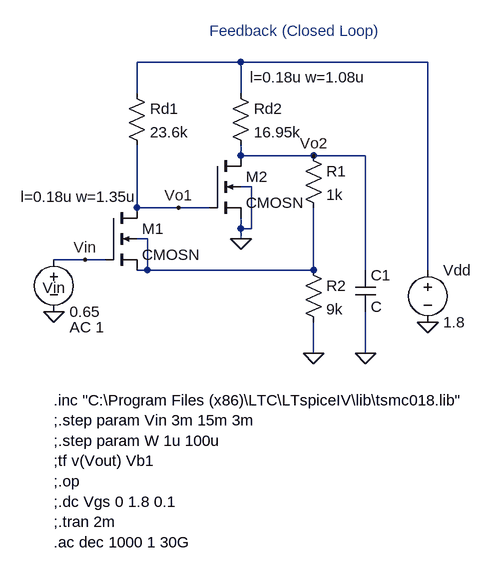
[diagram p0: schematic feedback1.asc]
feedback1.asc, the LTspice schematic file:
Version 4
SHEET 1 880 680
WIRE 224 -48 64 -48
WIRE 512 -48 224 -48
WIRE 64 0 64 -48
WIRE 224 0 224 -48
WIRE 224 96 224 80
WIRE 336 96 224 96
WIRE 416 96 336 96
WIRE 240 144 224 144
WIRE 64 176 64 80
WIRE 128 176 64 176
WIRE 176 176 128 176
WIRE 224 208 224 192
WIRE 240 208 240 144
WIRE 240 208 224 208
WIRE 80 224 64 224
WIRE 224 224 224 208
WIRE -16 256 -64 256
WIRE 16 256 -16 256
WIRE 80 272 80 224
WIRE 80 272 64 272
WIRE 336 272 336 176
WIRE 336 272 80 272
WIRE 416 272 416 96
WIRE 512 272 512 -48
WIRE 336 400 336 352
WIRE 416 400 416 336
FLAG 224 224 0
FLAG -64 336 0
FLAG 336 400 0
FLAG 512 352 0
FLAG 336 96 Vo2
FLAG -16 256 Vin
FLAG 128 176 Vo1
FLAG 416 400 0
SYMBOL cmosn 16 176 R0
WINDOW 123 -131 -17 Left 2
SYMATTR Value2 l=0.18u w=1.35u
SYMATTR InstName M1
SYMBOL cmosn 176 96 R0
WINDOW 123 62 -121 Left 2
SYMATTR Value2 l=0.18u w=1.08u
SYMATTR InstName M2
SYMBOL res 48 -16 R0
SYMATTR InstName Rd1
SYMATTR Value 23.6k
SYMBOL res 208 -16 R0
SYMATTR InstName Rd2
SYMATTR Value 16.95k
SYMBOL res 320 256 R0
SYMATTR InstName R2
SYMATTR Value 9k
SYMBOL res 320 80 R0
SYMATTR InstName R1
SYMATTR Value 1k
SYMBOL voltage -64 240 R0
WINDOW 0 -17 59 Left 2
WINDOW 123 24 120 Left 2
WINDOW 39 0 0 Left 2
SYMATTR InstName Vin
SYMATTR Value2 AC 1
SYMATTR Value 0.65
SYMBOL voltage 512 256 R0
WINDOW 123 0 0 Left 2
WINDOW 39 0 0 Left 2
SYMATTR InstName Vdd
SYMATTR Value 1.8
SYMBOL cap 400 272 R0
SYMATTR InstName C1
TEXT 176 -96 Left 2 ;Feedback (Closed Loop)
TEXT -64 472 Left 2 !.inc "C:\\Program Files (x86)\\LTC\\LTspiceIV\\lib\\tsmc018.lib"\n;.step param Vin 3m 15m 3m\n;.step param W 1u 100u\n;tf v(Vout) Vb1\n;.op\n;.dc Vgs 0 1.8 0.1\n;.tran 2m\n.ac dec 1000 1 30G

The netlist it stands for:
* feedback1.asc
M1 Vo1 Vin N002 N002 CMOSN l=0.18u w=1.35u
M2 Vo2 Vo1 0 0 CMOSN l=0.18u w=1.08u
Rd1 N001 Vo1 23.6k
Rd2 N001 Vo2 16.95k
R2 N002 0 9k
R1 Vo2 N002 1k
Vin Vin 0 0.65 AC 1
Vdd N001 0 1.8
C1 Vo2 0 C
.model NMOS NMOS
.model PMOS PMOS
.lib standard.mos
* Feedback (Closed Loop)
.inc "C:\Program Files (x86)\LTC\LTspiceIV\lib\tsmc018.lib"
;.step param Vin 3m 15m 3m
;.step param W 1u 100u
;tf v(Vout) Vb1
;.op
;.dc Vgs 0 1.8 0.1
;.tran 2m
.ac dec 1000 1 30G
.backanno
.end